# Altium schematic sheet Heater_FETS.SchDoc
size A; SheetNumber: 7; SheetTotal: 7
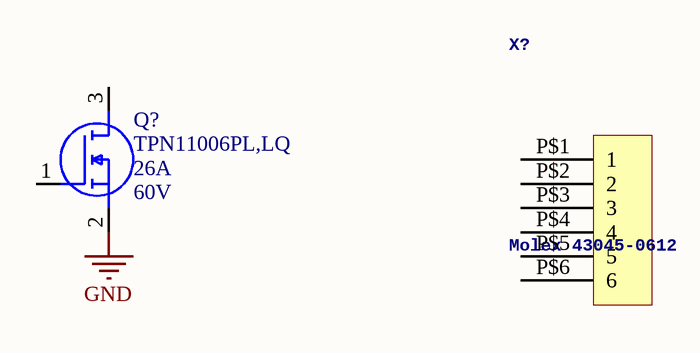
[diagram p0: Heater_FETS.SchDoc]

## Parts
Q?  TPN11006PL,LQ  Id-Continuous: 26A  VDS-Max: 60V  [NMOS-8TSON]
X?  Molex 43045-0612  [43045-0612]

## Nets
GND: Q?.2(S)

Not connected (* = marked no-connect by the designer): Q? 1(G) 3(D); X? P$1(1) P$2(2) P$3(3) P$4(4) P$5(5) P$6(6)

## Library data of the parts
Q? = NMOS-26A-0001: N-Channel 60 V 26A (Tc) 610mW (Ta), 61W (Tc) Surface Mount 8-TSON Advance (3.1x3.1); Manufacturer: Toshiba; Rds On-Max: 18.1mOhm; Vgs-Max: 20V; Assembled?: no; Manufacturer Part Number: TPN11006PL,LQ; FET type: N-Channel; Package: 8-TSON Advance
X? = Micro-Fit Molex 6 Pin 2 Row Vertical: GateName_1: G$1; SymbolName_1: HEADER_POS6; DeviceSetName: HEADER_POS6_?; DeviceName: 43045-0612; LibraryName: con-molex-micro-fit-3_0_2; Package: 43045-0612